# EAGLE design Nixie_Display (EAGLE 6.1)
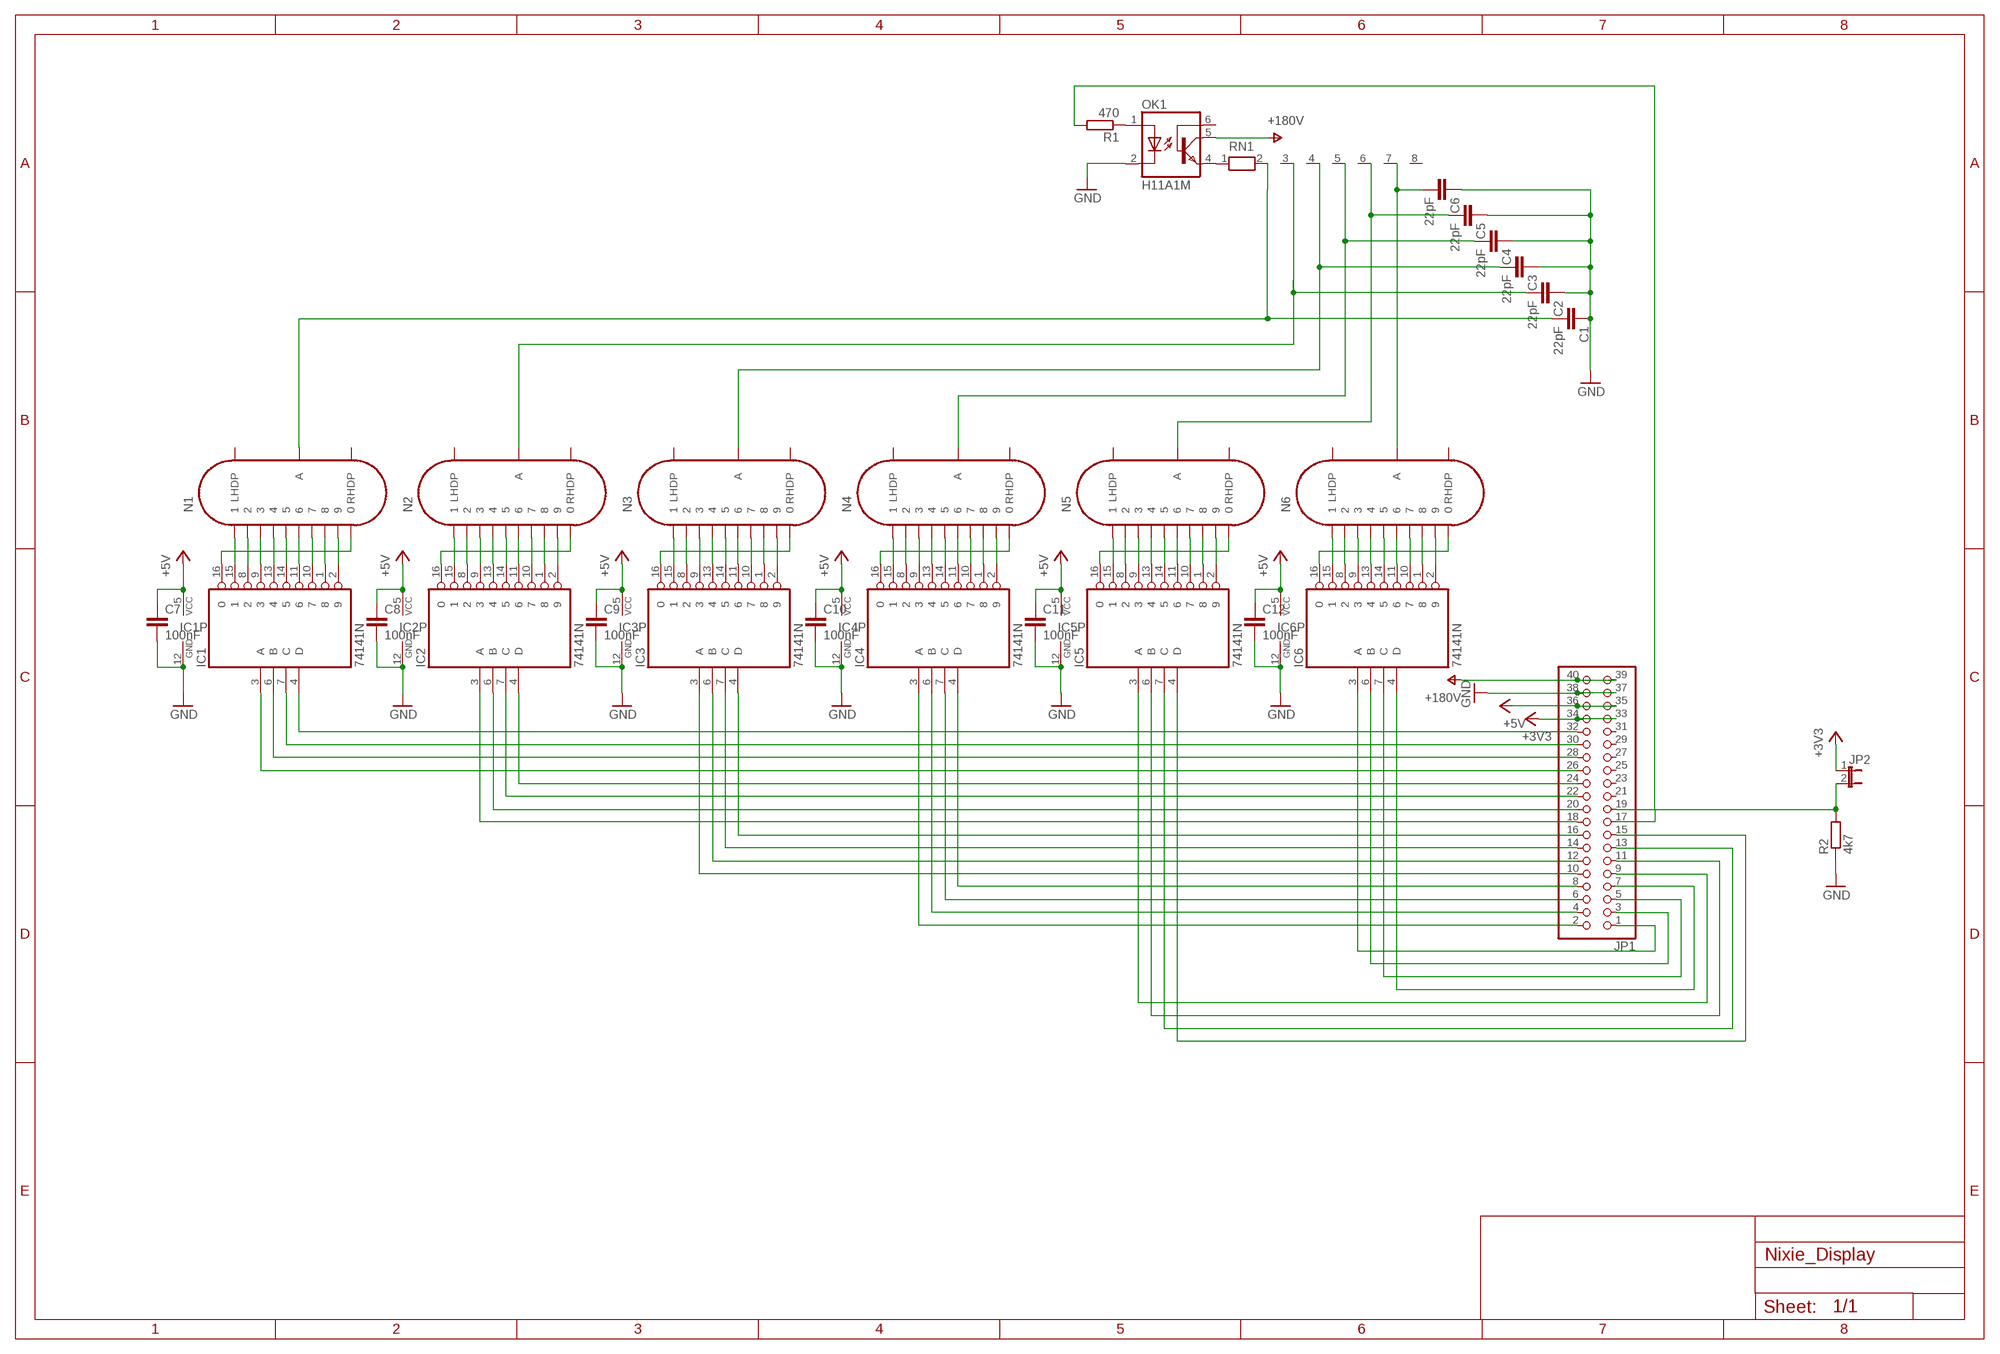
[diagram p0: schematic, sheet 1]

## Parts
C1  22pF  C-EU025-025X050  [C025-025X050]
C2  22pF  C-EU025-025X050  [C025-025X050]
C3  22pF  C-EU025-025X050  [C025-025X050]
C4  22pF  C-EU025-025X050  [C025-025X050]
C5  22pF  C-EU025-025X050  [C025-025X050]
C6  22pF  C-EU025-025X050  [C025-025X050]
C7  100nF  C-EU050-025X075  [C050-025X075]
C8  100nF  C-EU050-025X075  [C050-025X075]
C9  100nF  C-EU050-025X075  [C050-025X075]
C10  100nF  C-EU050-025X075  [C050-025X075]
C11  100nF  C-EU050-025X075  [C050-025X075]
C12  100nF  C-EU050-025X075  [C050-025X075]
IC1  74141N  [DIL16]
IC2  74141N  [DIL16]
IC3  74141N  [DIL16]
IC4  74141N  [DIL16]
IC5  74141N  [DIL16]
IC6  74141N  [DIL16]
JP1  PINHD-2X20  [2X20]
JP2  JP1E  [JP1]
N1  IN-14  [IN-14]
N2  IN-14  [IN-14]
N3  IN-14  [IN-14]
N4  IN-14  [IN-14]
N5  IN-14  [IN-14]
N6  IN-14  [IN-14]
OK1  H11A1M  [DIL06]
R1  470  R-EU_0207/10  [0207/10]
R2  4k7  R-EU_0207/10  [0207/10]
RN1  RN07  [RN-8]

## Nets
+3V3: JP1.33 JP1.34 JP2.1
+5V: C7.1 C8.1 C9.1 C10.1 C11.1 C12.1 IC1.5(VCC) IC2.5(VCC) IC3.5(VCC) IC4.5(VCC) IC5.5(VCC) IC6.5(VCC) JP1.35 JP1.36
GND: C1.1 C2.1 C3.1 C4.1 C5.1 C6.1 C7.2 C8.2 C9.2 C10.2 C11.2 C12.2 IC1.12(GND) IC2.12(GND) IC3.12(GND) IC4.12(GND) IC5.12(GND) IC6.12(GND) JP1.37 JP1.38 OK1.2(C) R2.1
N$1: IC1.16 N1.0
N$2: IC1.15 N1.1
N$3: IC1.8 N1.2
N$4: IC1.9 N1.3
N$5: IC1.13 N1.4
N$6: IC1.14 N1.5
N$7: IC1.11 N1.6
N$8: IC1.10 N1.7
N$9: IC1.1 N1.8
N$10: IC1.2 N1.9
N$11: IC2.16 N2.0
N$12: IC2.15 N2.1
N$13: IC2.8 N2.2
N$14: IC2.9 N2.3
N$15: IC2.13 N2.4
N$16: IC2.14 N2.5
N$17: IC2.11 N2.6
N$18: IC2.10 N2.7
N$19: IC2.1 N2.8
N$20: IC2.2 N2.9
N$21: IC3.16 N3.0
N$22: IC3.2 N3.9
N$23: IC3.1 N3.8
N$24: IC3.10 N3.7
N$25: IC3.11 N3.6
N$26: IC3.14 N3.5
N$27: IC3.13 N3.4
N$28: IC3.9 N3.3
N$29: IC3.8 N3.2
N$30: IC3.15 N3.1
N$31: IC4.16 N4.0
N$32: IC4.2 N4.9
N$33: IC4.1 N4.8
N$34: IC4.10 N4.7
N$35: IC4.11 N4.6
N$36: IC4.14 N4.5
N$37: IC4.13 N4.4
N$38: IC4.9 N4.3
N$39: IC4.8 N4.2
N$40: IC4.15 N4.1
N$41: IC5.16 N5.0
N$42: IC5.2 N5.9
N$43: IC5.1 N5.8
N$44: IC5.10 N5.7
N$45: IC5.11 N5.6
N$46: IC5.14 N5.5
N$47: IC5.13 N5.4
N$48: IC5.9 N5.3
N$49: IC5.8 N5.2
N$50: IC5.15 N5.1
N$51: IC6.16 N6.0
N$52: IC6.2 N6.9
N$53: IC6.1 N6.8
N$54: IC6.10 N6.7
N$55: IC6.11 N6.6
N$56: IC6.14 N6.5
N$57: IC6.13 N6.4
N$58: IC6.9 N6.3
N$59: IC6.8 N6.2
N$60: IC6.15 N6.1
N$61: IC6.3(A) JP1.1
N$62: IC6.6(B) JP1.3
N$63: IC6.7(C) JP1.5
N$64: IC6.4(D) JP1.7
N$65: IC5.3(A) JP1.9
N$66: IC5.6(B) JP1.11
N$67: IC5.7(C) JP1.13
N$68: IC5.4(D) JP1.15
N$69: IC4.3(A) JP1.2
N$70: IC4.6(B) JP1.4
N$71: IC4.7(C) JP1.6
N$72: IC4.4(D) JP1.8
N$73: OK1.4(EMI) RN1.1
N$74: IC3.3(A) JP1.10
N$75: IC3.6(B) JP1.12
N$76: C6.2 N6.A RN1.7
N$77: IC3.7(C) JP1.14
N$78: IC3.4(D) JP1.16
N$79: IC2.3(A) JP1.18
N$80: IC2.6(B) JP1.20
N$81: IC2.7(C) JP1.22
N$82: IC2.4(D) JP1.24
N$83: IC1.4(D) JP1.32
N$84: IC1.7(C) JP1.30
N$85: C5.2 N5.A RN1.6
N$86: C4.2 N4.A RN1.5
N$87: C3.2 N3.A RN1.4
N$88: C2.2 N2.A RN1.3
N$89: C1.2 N1.A RN1.2
N$90: JP1.17 R1.2
N$91: OK1.1(A) R1.1
N$92: IC1.6(B) JP1.28
N$93: IC1.3(A) JP1.26
N$101: JP1.19 JP2.2 R2.2
V+: JP1.39 JP1.40 OK1.5(COL) ; supply symbol labelled +180V
Unconnected: JP1.21 JP1.23 JP1.25 JP1.27 JP1.29 JP1.31 N1.LHDP N1.RHDP N2.LHDP N2.RHDP N3.LHDP N3.RHDP N4.LHDP N4.RHDP N5.LHDP N5.RHDP N6.LHDP N6.RHDP OK1.6(BAS) RN1.8

## Library data of the parts
C1-C12 = resistor:C-EU: CAPACITOR, European symbol
IC1-IC6 = 74xx-eu:74*141: BCD to decimal DECODER/DRIVER
JP1 = pinhead:PINHD-2X20: PIN HEADER
JP2 = jumper:JP1E: JUMPER
N1-N6 = russian-nixies:IN-14: IN-14: medium numeric frontview nixie tube
OK1 = optocoupler:H11A*?M: General Purpose 6-Pin Phototransistor Optocouplers Source: http://www.fairchildsemi.com/ds/4N/4N35-M.pdf; MPN: H11A1-M; OC_FARNELL: 1021358; OC_NEWARK: 97K1793
R1 R2 = resistor:R-EU_: RESISTOR, European symbol
RN1 = resistor-net:RN07: RESISTOR NETWORK; OC_FARNELL: unknown; OC_NEWARK: unknown

## Board
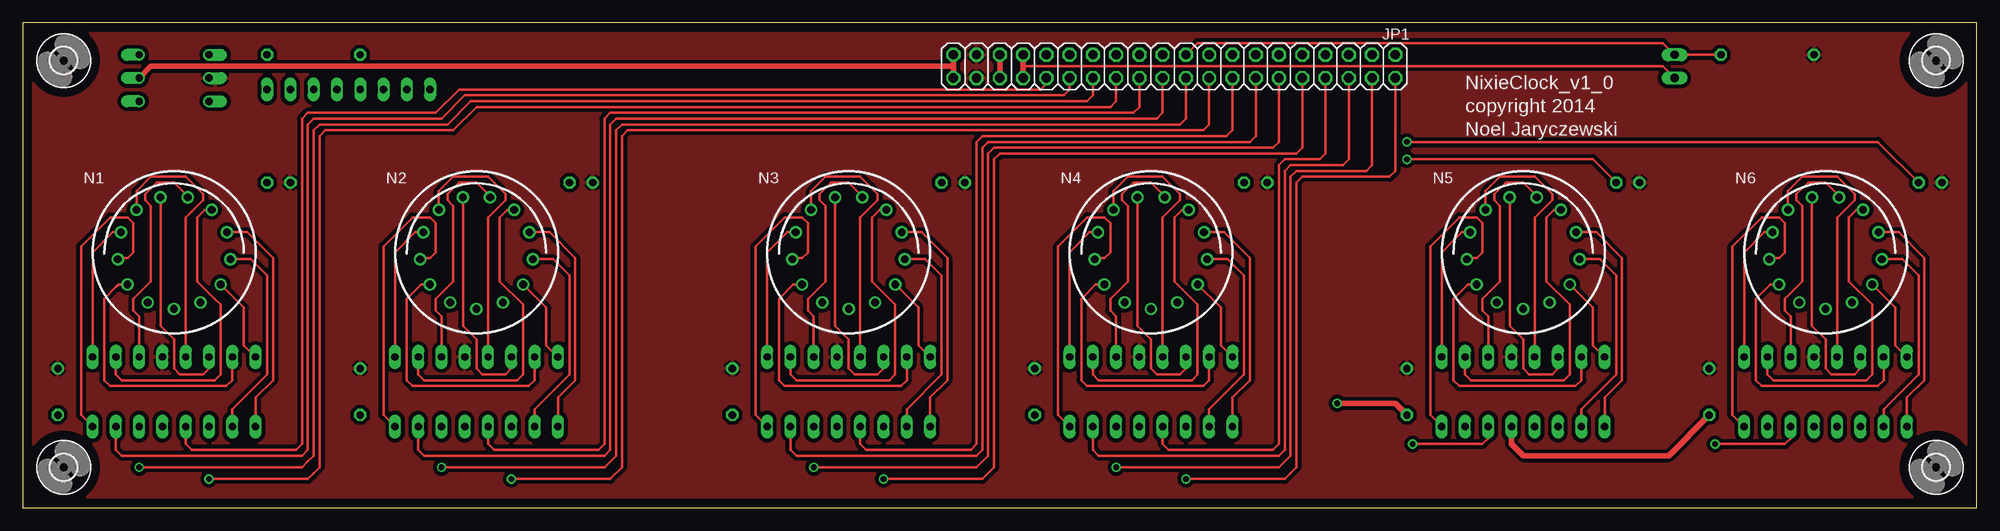
[diagram p1: board, top side]
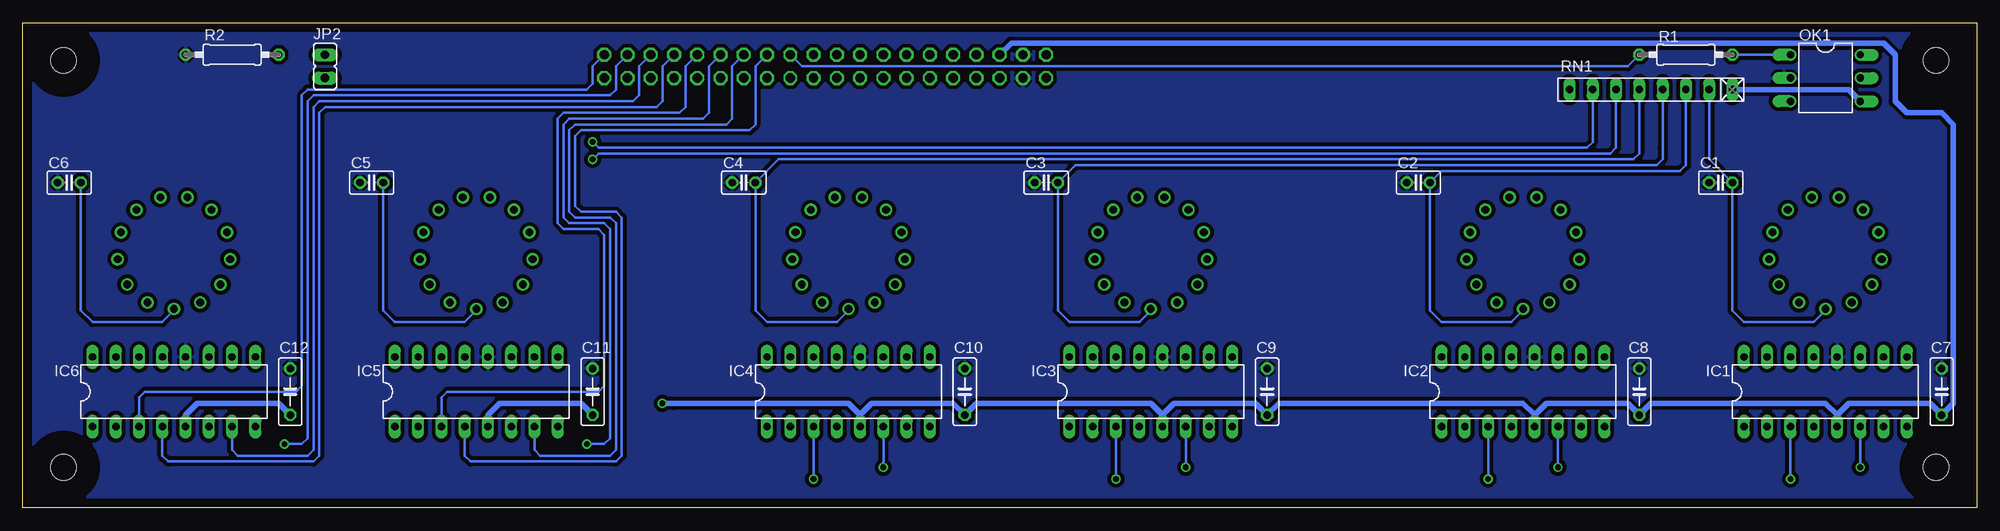
[diagram p2: board, bottom side, seen from below]

Size 213.34 x 53.01 mm. Coordinates in mm from the lower left corner, seen from the top.
Outline: 0,0 213.34,0 213.34,53.01 0,53.01 0,0
Copper layers (1*16): Top 0.035mm / dielectric 1.5mm / Bottom 0.035mm
Design rules: minimum track width 10mil, minimum drill 24mil, track to track 8mil, track to pad 8mil, pad to pad 8mil, via to via 8mil, smd to smd 8mil, copper to edge 40mil, drill to drill 8mil, minimum pad ring 10mil, minimum via ring 8mil, stop-mask expansion 4mil, vias tented up to drill 0mil, thermal gap 10mil

### Footprints (pad centres in the part's own frame; a part is rotated, then mirrored left to right if it is on the bottom)
C025-025X050 = drill 0.813 octagon: 1 -1.27,0; 2 1.27,0
C050-025X075 = drill 0.813 octagon: 1 -2.54,0; 2 2.54,0
DIL16 = drill 0.813 long: 1 -8.89,-3.81; 2 -6.35,-3.81; 3 -3.81,-3.81; 4 -1.27,-3.81; 5 1.27,-3.81; 6 3.81,-3.81; 7 6.35,-3.81; 8 8.89,-3.81; 9 8.89,3.81; 10 6.35,3.81; 11 3.81,3.81; 12 1.27,3.81; 13 -1.27,3.81; 14 -3.81,3.81; 15 -6.35,3.81; 16 -8.89,3.81
2X20 = drill 1.016 octagon: 1 -24.13,-1.27; 2 -24.13,1.27; 3 -21.59,-1.27; 4 -21.59,1.27; 5 -19.05,-1.27; 6 -19.05,1.27; 7 -16.51,-1.27; 8 -16.51,1.27; 9 -13.97,-1.27; 10 -13.97,1.27; 11 -11.43,-1.27; 12 -11.43,1.27; 13 -8.89,-1.27; 14 -8.89,1.27; 15 -6.35,-1.27; 16 -6.35,1.27; 17 -3.81,-1.27; 18 -3.81,1.27; 19 -1.27,-1.27; 20 -1.27,1.27; 21 1.27,-1.27; 22 1.27,1.27; 23 3.81,-1.27; 24 3.81,1.27; 25 6.35,-1.27; 26 6.35,1.27; 27 8.89,-1.27; 28 8.89,1.27; 29 11.43,-1.27; 30 11.43,1.27; 31 13.97,-1.27; 32 13.97,1.27; 33 16.51,-1.27; 34 16.51,1.27; 35 19.05,-1.27; 36 19.05,1.27; 37 21.59,-1.27; 38 21.59,1.27; 39 24.13,-1.27; 40 24.13,1.27
JP1 = drill 0.914 long: 1 0,-1.27; 2 0,1.27
IN-14 = drill 0.84: 0 5.094,-3.516; 1 -5.094,-3.516; 2 -6.145,-0.746; 3 -5.788,2.195; 4 -4.105,4.633; 5 -1.481,6.01; 6 1.481,6.01; 7 4.105,4.633; 8 5.788,2.195; 9 6.145,-0.746; A 0,-6.19; LHDP 2.877,-5.481; RHDP -2.877,-5.481
DIL06 = drill 0.813 offset: 1 -2.54,-3.81; 2 0,-3.81; 3 2.54,-3.81; 4 2.54,3.81; 5 0,3.81; 6 -2.54,3.81
0207/10 = drill 0.813 octagon: 1 -5.08,0; 2 5.08,0
RN-8 = drill 0.813 long: 1 -8.89,0; 2 -6.35,0; 3 -3.81,0; 4 -1.27,0; 5 1.27,0; 6 3.81,0; 7 6.35,0; 8 8.89,0
2,8 = hole 2.8: 0,0

### Placement (x,y rotation side)
C1  27.94,35.56 0 bottom
C2  60.96,35.56 0 bottom
C3  101.6,35.56 0 bottom
C4  134.62,35.56 0 bottom
C5  175.26,35.56 0 bottom
C6  208.28,35.56 0 bottom
C7  3.81,12.7 90 bottom
C8  36.83,12.7 90 bottom
C9  77.47,12.7 90 bottom
C10  110.49,12.7 90 bottom
C11  151.13,12.7 90 bottom
C12  184.15,12.7 90 bottom
IC1  16.51,12.7 0 bottom
IC2  49.53,12.7 0 bottom
IC3  90.17,12.7 0 bottom
IC4  123.19,12.7 0 bottom
IC5  163.83,12.7 0 bottom
IC6  196.85,12.7 0 bottom
JP1  125.73,48.26 180 top
JP2  180.34,48.26 0 bottom
N1  16.51,27.94 0 top
N2  49.53,27.94 0 top
N3  90.17,27.94 0 top
N4  123.19,27.94 0 top
N5  163.83,27.94 0 top
N6  196.85,27.94 0 top
OK1  16.51,46.99 270 bottom
R1  31.75,49.53 180 bottom
R2  190.5,49.53 0 bottom
RN1  35.56,45.72 180 bottom
U$1  [2,8]  4.45,48.9 0 top
U$2  [2,8]  4.45,4.45 0 top
U$3  [2,8]  208.91,48.9 0 top
U$4  [2,8]  208.91,4.45 0 top

### Tracks (layer width: path | path; a pad name or v marks a point on that pad's centre or on a via)
+3V3
  Top 0.254: 109.22,48.26 179.07,48.26 JP2.1
  Top 0.61: JP1.33 109.22,48.26 JP1.34
+5V  (via drill 0.61)
  Top 0.61: IC5.5 162.56,6.99 163.83,5.71 179.71,5.71 C12.1 | v143.51,11.43 149.86,11.43 C11.1 | JP1.36 JP1.35
  Bottom 0.61: IC5.5 162.56,10.16 161.29,11.43 152.4,11.43 C11.1 | IC6.5 195.58,10.16 194.31,11.43 185.42,11.43 C12.1 | 15.24,10.16 13.97,11.43 5.08,11.43 C7.1 2.54,11.43 2.54,41.91 3.81,43.18 7.62,43.18 8.89,44.45 8.89,49.53 10.16,50.8 105.41,50.8 JP1.35 | 15.24,10.16 IC1.5 15.24,10.16 | 15.24,10.16 16.51,11.43 35.56,11.43 C8.1 38.1,11.43 46.99,11.43 48.26,10.16 | 48.26,10.16 IC2.5 48.26,10.16 | 48.26,10.16 49.53,11.43 76.2,11.43 C9.1 78.74,11.43 87.63,11.43 88.9,10.16 | 88.9,10.16 IC3.5 88.9,10.16 | 88.9,10.16 90.17,11.43 109.22,11.43 C10.1 111.76,11.43 120.65,11.43 121.92,10.16 | 121.92,10.16 IC4.5 121.92,10.16 | 121.92,10.16 123.19,11.43 142.24,11.43 v143.51,11.43
GND
  pour Bottom (isolate 0.406): -1.27,54.61 214.63,54.61 214.63,-1.27 -1.27,-1.27
  pour Top (isolate 0.406): -1.27,54.61 214.63,54.61 214.63,-1.27 -1.27,-1.27
N$1
  Top 0.254: IC1.16 24.13,17.78 24.13,21.9 N1.0
N$2
  Top 0.254: N1.1 10.45,24.42 10.16,24.13 8.89,22.86 8.89,13.97 9.53,13.34 22.23,13.34 22.86,13.97 IC1.15
N$3
  Top 0.254: IC1.8 6.35,10.16 6.35,28.57 9.53,31.75 10.79,31.75 11.43,31.75 12.06,31.11 12.06,27.94 11.43,27.3 10.48,27.3 N1.2
N$4
  Top 0.254: N1.3 9.81,30.14 7.62,27.94 IC1.9
N$5
  Top 0.254: N1.4 12.4,34.63 13.97,36.2 17.78,36.2 19.68,34.29 19.68,33.66 18.41,32.38 17.78,31.75 IC1.13
N$6
  Top 0.254: N1.5 15.03,19.9 16.51,18.41 16.51,15.24 17.14,14.61 19.68,14.61 20.32,15.24 IC1.14
N$7
  Top 0.254: N1.6 17.99,34.08 16.51,35.56 14.61,35.56 13.97,34.92 13.34,34.29 13.34,33.66 13.97,33.02 13.97,24.77 12.06,22.86 12.06,21.59 12.7,20.95 IC1.11
N$8
  Top 0.254: N1.7 19.87,32.57 19.05,31.75 19.05,24.77 20.95,22.86 21.59,22.23 21.59,14.61 20.95,13.97 10.79,13.97 10.16,14.61 IC1.10
N$9
  Top 0.254: N1.8 24.48,30.14 27.3,27.3 27.3,13.97 25.4,12.06 IC1.1
N$10
  Top 0.254: N1.9 24.88,27.19 26.67,25.4 26.67,14.61 22.86,10.79 IC1.2
N$11
  Top 0.254: IC2.16 57.15,17.78 57.15,21.9 N2.0
N$12
  Top 0.254: N2.1 43.47,24.42 41.91,22.86 41.91,13.97 42.55,13.34 55.24,13.34 55.88,13.97 IC2.15
N$13
  Top 0.254: IC2.8 39.37,10.16 39.37,28.57 42.55,31.75 44.45,31.75 45.09,31.11 45.09,27.94 44.45,27.3 43.5,27.3 N2.2
N$14
  Top 0.254: N2.3 42.84,30.14 40.64,27.94 IC2.9
N$15
  Top 0.254: N2.4 45.42,34.63 46.99,36.2 50.8,36.2 52.7,34.29 52.7,33.66 50.8,31.75 IC2.13
N$16
  Top 0.254: N2.5 48.05,19.9 49.53,18.41 49.53,15.24 50.16,14.61 52.7,14.61 53.34,15.24 IC2.14
N$17
  Top 0.254: N2.6 51.01,34.08 49.53,35.56 47.62,35.56 46.35,34.29 46.35,33.66 46.99,33.02 46.99,24.77 45.09,22.86 45.09,21.59 45.72,20.95 IC2.11
N$18
  Top 0.254: N2.7 52.89,32.57 52.07,31.75 52.07,24.77 54.61,22.23 54.61,14.61 53.98,13.97 43.81,13.97 43.18,14.61 IC2.10
N$19
  Top 0.254: N2.8 57.49,30.14 60.33,27.3 60.33,13.97 58.42,12.06 IC2.1
N$20
  Top 0.254: N2.9 57.9,27.19 59.69,25.4 59.69,14.61 55.88,10.79 IC2.2
N$21
  Top 0.254: IC3.16 97.79,17.78 97.79,21.9 N3.0
N$22
  Top 0.254: N3.9 98.54,27.19 100.33,25.4 100.33,14.61 96.52,10.79 IC3.2
N$23
  Top 0.254: N3.8 98.14,30.14 100.97,27.3 100.97,13.97 99.06,12.06 IC3.1
N$24
  Top 0.254: N3.7 93.53,32.57 92.71,31.75 92.71,24.77 95.25,22.23 95.25,14.61 94.61,13.97 84.45,13.97 83.82,14.61 IC3.10
N$25
  Top 0.254: N3.6 91.65,34.08 90.17,35.56 88.27,35.56 87,34.29 87,33.66 87.63,33.02 87.63,24.77 85.72,22.86 85.72,21.59 86.36,20.95 IC3.11
N$26
  Top 0.254: N3.5 88.69,19.9 90.17,18.41 90.17,15.24 90.81,14.61 93.34,14.61 93.98,15.24 IC3.14
N$27
  Top 0.254: N3.4 86.06,34.63 87.63,36.2 91.44,36.2 93.34,34.29 93.34,33.66 91.44,31.75 IC3.13
N$28
  Top 0.254: N3.3 83.47,30.14 81.28,27.94 IC3.9
N$29
  Top 0.254: IC3.8 80.01,10.16 80.01,28.57 83.19,31.75 85.09,31.75 85.72,31.11 85.72,27.94 85.09,27.3 84.14,27.3 N3.2
N$30
  Top 0.254: N3.1 84.11,24.42 82.55,22.86 82.55,13.97 83.19,13.34 95.89,13.34 96.52,13.97 IC3.15
N$31
  Top 0.254: IC4.16 130.81,17.78 130.81,21.9 N4.0
N$32
  Top 0.254: N4.9 131.56,27.19 133.35,25.4 133.35,14.61 129.54,10.79 IC4.2
N$33
  Top 0.254: N4.8 131.16,30.14 133.99,27.3 133.99,13.97 132.08,12.06 IC4.1
N$34
  Top 0.254: N4.7 126.55,32.57 125.73,31.75 125.73,24.77 128.27,22.23 128.27,14.61 127.64,13.97 117.47,13.97 116.84,14.61 IC4.10
N$35
  Top 0.254: N4.6 124.67,34.08 123.19,35.56 121.28,35.56 120.02,34.29 120.02,33.66 120.65,33.02 120.65,24.77 118.75,22.86 118.75,21.59 119.38,20.95 IC4.11
N$36
  Top 0.254: N4.5 121.71,19.9 123.19,18.41 123.19,15.24 123.83,14.61 126.36,14.61 127,15.24 IC4.14
N$37
  Top 0.254: N4.4 119.08,34.63 120.65,36.2 124.46,36.2 126.36,34.29 126.36,33.66 124.46,31.75 IC4.13
N$38
  Top 0.254: N4.3 116.5,30.14 114.3,27.94 IC4.9
N$39
  Top 0.254: IC4.8 113.03,10.16 113.03,28.57 116.2,31.75 118.11,31.75 118.75,31.11 118.75,27.94 118.11,27.3 117.16,27.3 N4.2
N$40
  Top 0.254: N4.1 117.13,24.42 115.57,22.86 115.57,13.97 116.2,13.34 128.91,13.34 129.54,13.97 IC4.15
N$41
  Top 0.254: IC5.16 171.45,17.78 171.45,21.9 N5.0
N$42
  Top 0.254: N5.9 172.2,27.19 173.99,25.4 173.99,14.61 170.18,10.79 IC5.2
N$43
  Top 0.254: N5.8 171.79,30.14 174.62,27.3 174.62,13.97 172.72,12.06 IC5.1
N$44
  Top 0.254: N5.7 167.19,32.57 166.37,31.75 166.37,24.77 168.91,22.23 168.91,14.61 168.28,13.97 158.12,13.97 157.48,14.61 IC5.10
N$45
  Top 0.254: N5.6 165.31,34.08 163.83,35.56 161.93,35.56 160.66,34.29 160.66,33.66 161.29,33.02 161.29,24.77 159.38,22.86 159.38,21.59 160.02,20.95 IC5.11
N$46
  Top 0.254: N5.5 162.35,19.9 163.83,18.41 163.83,15.24 164.47,14.61 167,14.61 167.64,15.24 IC5.14
N$47
  Top 0.254: N5.4 159.72,34.63 161.29,36.2 165.1,36.2 167,34.29 167,33.66 165.1,31.75 IC5.13
N$48
  Top 0.254: N5.3 157.13,30.14 156.21,29.21 154.94,27.94 IC5.9
N$49
  Top 0.254: IC5.8 153.67,10.16 153.67,28.57 156.84,31.75 158.75,31.75 159.38,31.11 159.38,27.94 158.75,27.3 157.8,27.3 N5.2
N$50
  Top 0.254: N5.1 157.77,24.42 156.21,22.86 156.21,13.97 156.84,13.34 169.54,13.34 170.18,13.97 IC5.15
N$51
  Top 0.254: IC6.16 204.47,17.78 204.47,21.9 N6.0
N$52
  Top 0.254: N6.9 205.22,27.19 207.01,25.4 207.01,14.61 203.2,10.79 IC6.2
N$53
  Top 0.254: N6.8 204.81,30.14 207.65,27.3 207.65,13.97 205.74,12.06 IC6.1
N$54
  Top 0.254: N6.7 200.21,32.57 199.39,31.75 199.39,24.77 201.93,22.23 201.93,14.61 201.29,13.97 191.13,13.97 190.5,14.61 IC6.10
N$55
  Top 0.254: N6.6 198.33,34.08 196.85,35.56 194.94,35.56 193.68,34.29 193.68,33.66 194.31,33.02 194.31,24.77 192.41,22.86 192.41,21.59 193.04,20.95 IC6.11
N$56
  Top 0.254: N6.5 195.37,19.9 196.85,18.41 196.85,15.24 197.49,14.61 200.03,14.61 200.66,15.24 IC6.14
N$57
  Top 0.254: N6.4 192.75,34.63 194.31,36.2 198.12,36.2 200.03,34.29 200.03,33.66 198.12,31.75 IC6.13
N$58
  Top 0.254: N6.3 190.16,30.14 187.96,27.94 IC6.9
N$59
  Top 0.254: IC6.8 186.69,10.16 186.69,28.57 189.87,31.75 191.77,31.75 192.41,31.11 192.41,27.94 191.77,27.3 190.82,27.3 N6.2
N$60
  Top 0.254: N6.1 190.79,24.42 189.23,22.86 189.23,13.97 189.87,13.34 202.56,13.34 203.2,13.97 IC6.15
N$61
  Bottom 0.254: JP1.1 151.13,48.26 151.13,46.35 151.76,45.72 182.25,45.72 182.88,45.09 182.88,13.34 183.51,12.7 200.03,12.7 200.66,12.06 200.66,10.16 IC6.3
N$62  (via drill 0.61)
  Top 0.254: v184.78,6.99 192.41,6.99 193.04,7.62 IC6.6
  Bottom 0.254: JP1.3 148.59,48.26 148.59,45.72 149.22,45.09 181.61,45.09 182.25,44.45 182.25,7.62 182.88,6.99 v184.78,6.99
N$63
  Bottom 0.254: JP1.5 146.05,48.26 146.05,45.09 146.69,44.45 180.97,44.45 181.61,43.81 181.61,6.35 182.25,5.71 189.87,5.71 190.5,6.35 IC6.7
N$64
  Bottom 0.254: JP1.7 143.51,48.26 143.51,44.45 144.15,43.81 180.34,43.81 180.97,43.18 180.97,5.71 181.61,5.08 197.49,5.08 198.12,5.71 IC6.4
N$65
  Bottom 0.254: JP1.9 140.97,48.26 140.97,43.81 141.6,43.18 154.31,43.18 154.94,42.55 154.94,31.11 154.31,30.48 150.5,30.48 149.86,29.84 149.86,13.34 150.5,12.7 167,12.7 167.64,12.06 167.64,10.16 IC5.3
N$66  (via drill 0.61)
  Top 0.254: v151.76,6.99 159.38,6.99 160.02,7.62 IC5.6
  Bottom 0.254: JP1.11 138.43,48.26 138.43,43.18 139.06,42.55 153.67,42.55 154.31,41.91 154.31,36.83 154.31,31.75 153.67,31.11 149.86,31.11 149.22,30.48 149.22,7.62 149.86,6.99 v151.76,6.99
N$67
  Bottom 0.254: JP1.13 135.89,48.26 135.89,42.55 136.53,41.91 153.03,41.91 153.67,41.27 153.67,36.2 153.67,32.38 153.03,31.75 149.22,31.75 148.59,31.11 148.59,6.35 149.22,5.71 156.84,5.71 157.48,6.35 IC5.7
N$68
  Bottom 0.254: JP1.15 133.35,48.26 133.35,41.91 133.99,41.27 152.4,41.27 153.03,40.64 153.03,33.02 152.4,32.38 148.59,32.38 147.96,31.75 147.96,5.71 148.59,5.08 164.47,5.08 165.1,5.71 IC5.4
N$69  (via drill 0.61)
  Top 0.254: JP1.2 149.86,36.83 149.22,36.2 139.7,36.2 139.06,35.56 139.06,4.45 138.43,3.81 137.79,3.17 v127,3.17
  Bottom 0.254: v127,3.17 IC4.3
N$70  (via drill 0.61)
  Top 0.254: JP1.4 147.32,37.47 146.69,36.83 139.06,36.83 138.43,36.2 138.43,5.71 137.16,4.45 v119.38,4.45
  Bottom 0.254: v119.38,4.45 IC4.6
N$71
  Top 0.254: JP1.6 144.78,38.1 144.15,37.47 138.43,37.47 137.79,36.83 137.79,6.35 137.16,5.71 117.47,5.71 116.84,6.35 IC4.7
N$72
  Top 0.254: JP1.8 142.24,38.73 141.6,38.1 137.79,38.1 137.16,37.47 137.16,6.99 136.53,6.35 125.09,6.35 124.46,6.99 IC4.4
N$73
  Bottom 0.61: OK1.4 13.97,45.72 RN1.1
N$74  (via drill 0.61)
  Top 0.254: JP1.10 139.7,39.37 139.06,38.73 106.68,38.73 106.05,38.1 106.05,4.45 104.78,3.17 v93.98,3.17
  Bottom 0.254: v93.98,3.17 IC3.3
N$75  (via drill 0.61)
  Top 0.254: JP1.12 137.16,40.01 136.53,39.37 106.05,39.37 105.41,38.73 105.41,5.71 104.14,4.45 v86.36,4.45
  Bottom 0.254: v86.36,4.45 IC3.6
N$76  (via drill 0.61)
  Top 0.254: v151.13,40.01 202.56,40.01 C6.2
  Bottom 0.254: N6.A 196.85,21.59 198.12,20.32 205.74,20.32 207.01,21.59 C6.2 | v151.13,40.01 150.5,39.37 42.55,39.37 41.91,40.01 RN1.7
N$77
  Top 0.254: JP1.14 134.62,40.64 133.99,40.01 105.41,40.01 104.78,39.37 104.78,6.35 104.14,5.71 84.45,5.71 83.82,6.35 IC3.7
N$78
  Top 0.254: JP1.16 132.08,41.27 131.44,40.64 104.78,40.64 104.14,40.01 104.14,6.99 103.5,6.35 92.08,6.35 91.44,6.99 IC3.4
N$79  (via drill 0.61)
  Top 0.254: JP1.18 129.54,41.91 128.91,41.27 66.04,41.27 65.41,40.64 65.41,4.45 64.14,3.17 v53.34,3.17
  Bottom 0.254: v53.34,3.17 IC2.3
N$80  (via drill 0.61)
  Top 0.254: JP1.20 127,42.55 126.36,41.91 65.41,41.91 64.77,41.27 64.77,5.71 63.5,4.45 v45.72,4.45
  Bottom 0.254: v45.72,4.45 IC2.6
N$81
  Top 0.254: JP1.22 124.46,43.18 123.83,42.55 64.77,42.55 64.14,41.91 64.14,6.35 63.5,5.71 43.81,5.71 43.18,6.35 IC2.7
N$82
  Top 0.254: JP1.24 121.92,43.81 121.28,43.18 64.14,43.18 63.5,42.55 63.5,6.99 62.87,6.35 51.44,6.35 50.8,6.99 IC2.4
N$83
  Top 0.254: JP1.32 111.76,46.35 111.12,45.72 47.62,45.72 45.09,43.18 31.11,43.18 30.48,42.55 30.48,6.99 29.84,6.35 18.41,6.35 17.78,6.99 IC1.4
N$84
  Top 0.254: JP1.30 114.3,45.72 113.67,45.09 48.26,45.09 45.72,42.55 31.75,42.55 31.11,41.91 31.11,6.35 30.48,5.71 10.79,5.71 10.16,6.35 IC1.7
N$85  (via drill 0.61)
  Top 0.254: v151.13,38.1 171.45,38.1 C5.2
  Bottom 0.254: N5.A 163.83,21.59 165.1,20.32 172.72,20.32 173.99,21.59 C5.2 | v151.13,38.1 150.5,38.73 40.01,38.73 39.37,39.37 RN1.6
N$86
  Bottom 0.254: N4.A 123.19,21.59 124.46,20.32 132.08,20.32 133.35,21.59 C4.2 130.81,38.1 37.47,38.1 36.83,38.73 RN1.5
N$87
  Bottom 0.254: N3.A 90.17,21.59 91.44,20.32 99.06,20.32 100.33,21.59 C3.2 98.42,37.47 34.92,37.47 34.29,38.1 34.29,39.37 RN1.4
N$88
  Bottom 0.254: N2.A 49.53,21.59 50.8,20.32 58.42,20.32 59.69,21.59 C2.2 58.42,36.83 32.38,36.83 31.75,37.47 RN1.3
N$89
  Bottom 0.254: N1.A 16.51,21.59 17.78,20.32 25.4,20.32 26.67,21.59 C1.2 29.21,38.1 RN1.2
N$90
  Bottom 0.254: R1.2 38.1,48.26 128.27,48.26 JP1.17
N$91
  Bottom 0.254: R1.1 OK1.1
N$92  (via drill 0.61)
  Top 0.254: JP1.28 116.84,45.09 116.2,44.45 48.9,44.45 46.35,41.91 32.38,41.91 31.75,41.27 31.75,5.71 31.11,5.08 30.48,4.45 v12.7,4.45
  Bottom 0.254: v12.7,4.45 IC1.6
N$93  (via drill 0.61)
  Top 0.254: JP1.26 119.38,44.45 118.75,43.81 49.53,43.81 46.99,41.27 33.02,41.27 32.38,40.64 32.38,4.45 31.75,3.81 31.11,3.17 v20.32,3.17
  Bottom 0.254: v20.32,3.17 IC1.3
N$101
  Top 0.254: R2.2 JP2.2 179.07,50.8 128.27,50.8 JP1.19
V+
  Top 0.61: JP1.39 101.6,48.26 | 101.6,48.26 JP1.40 | OK1.5 13.97,48.26 101.6,48.26

### Text on the board
tNames: NixieClock_v1_0 | copyright 2014 | Noel Jaryczewski